# Altium project OTA.PrjPCB
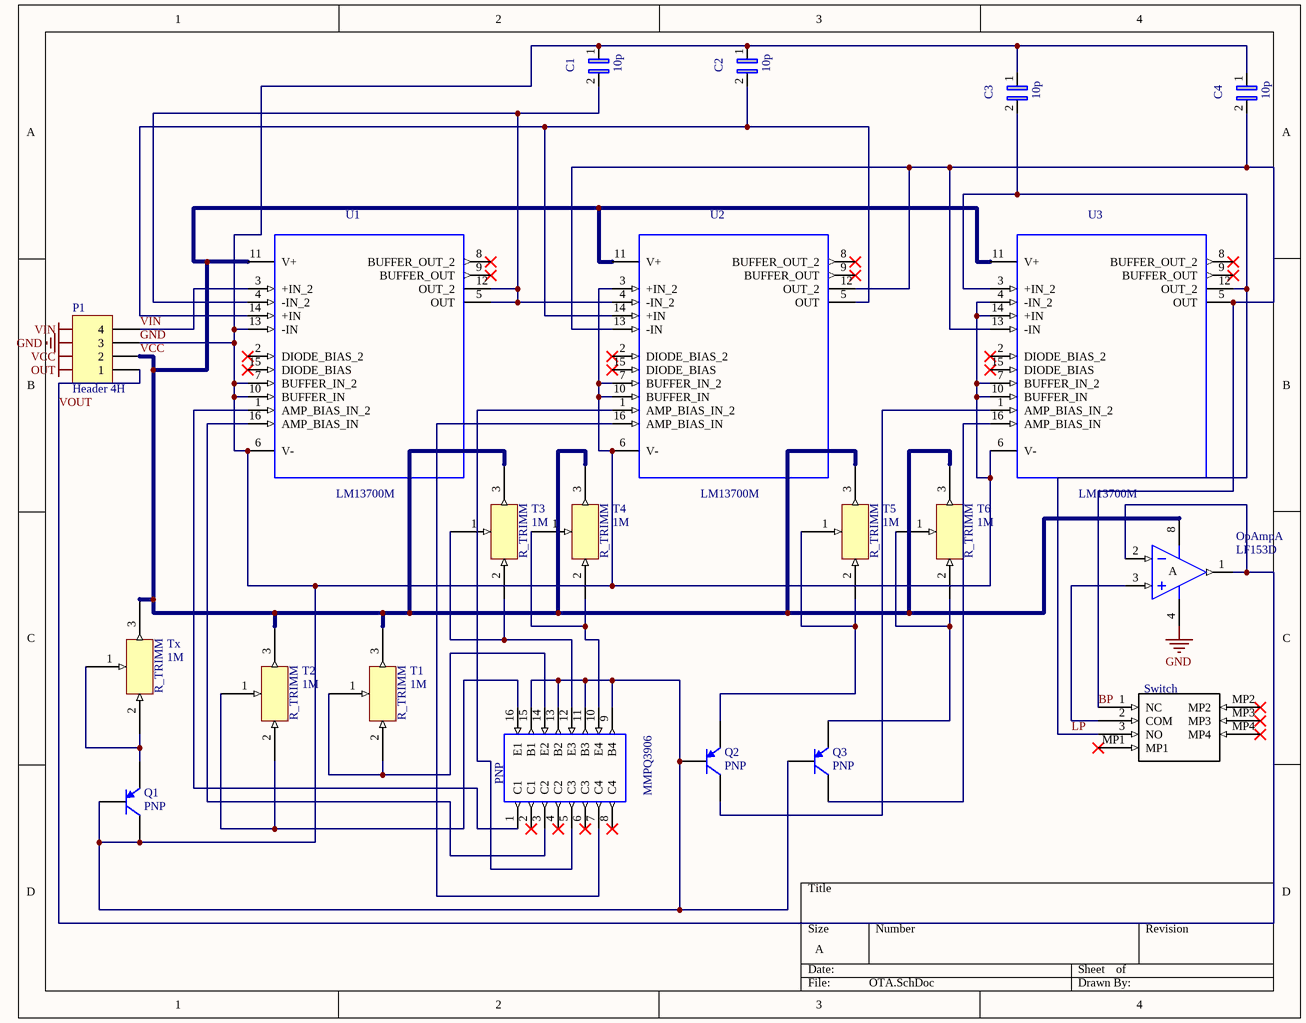
[diagram p0: OTA.SchDoc]
1 sheet, 21 parts. Net scope: global (net labels, ports and power ports of the same name join across sheets).
Board file: OTA1.PcbDoc

## Sheet OTA.SchDoc
size A

### Parts
C1  10p  [_C*CAPC1005X55N_CC0402C100K5GACAUTO_CPrimary_C]
C2  10p  [_C*CAPC1005X55N_CC0402C100K5GACAUTO_CPrimary_C]
C3  10p  [_C*CAPC1005X55N_CC0402C100K5GACAUTO_CPrimary_C]
C4  10p  [_C*CAPC1005X55N_CC0402C100K5GACAUTO_CPrimary_C]
OpAmp  LF153D  [SO8_N]  (part A of 2)
P1  Header 4H  [HDR1X4H]
PNP  MMPQ3906  [LM13700LM13700MLM13700LM13700MLM13700PrimaryLM13700]
Q1  PNP  [SOT-23B]
Q2  PNP  [SOT-23B]
Q3  PNP  [SOT-23B]
Switch  (no value)  [PCBComponent_1]
T1  1M  [PCBComponent_1]
T2  1M  [PCBComponent_1]
T3  1M  [PCBComponent_1]
T4  1M  [PCBComponent_1]
T5  1M  [PCBComponent_1]
T6  1M  [PCBComponent_1]
Tx  1M  [PCBComponent_1]
U1  LM13700M  [LM13700LM13700MLM13700LM13700MLM13700PrimaryLM13700]
U2  LM13700M  [LM13700LM13700MLM13700LM13700MLM13700PrimaryLM13700]
U3  LM13700M  [LM13700LM13700MLM13700LM13700MLM13700PrimaryLM13700]

### Nets
GND: C1.1 C2.1 C3.1 C4.1 OpAmp.4(V-) P1.3 PNP.9(B4) PNP.11(B3) PNP.13(B2) PNP.15(B1) Q1.1(C) Q1.2(B) Q2.2(B) Q3.2(B) U1.6(V-) U1.7(BUFFER_IN_2) U1.10(BUFFER_IN) U1.13(-IN) U2.3(+IN_2) U2.6(V-) U2.7(BUFFER_IN_2) U2.10(BUFFER_IN) U3.4(-IN_2) U3.6(V-) U3.7(BUFFER_IN_2) U3.10(BUFFER_IN) U3.14(+IN)
VCC: OpAmp.8(V+) P1.2 T1.3 T2.3 T3.3 T4.3 T5.3 T6.3 Tx.3 U1.11(V+) U2.11(V+) U3.11(V+)
VIN: P1.4 U1.3(+IN_2)
BP: C4.2 Switch.1(NC) U2.12(OUT_2) U2.13(-IN) U3.5(OUT) U3.13(-IN)
LP: C3.2 Switch.3(NO) U3.3(+IN_2) U3.12(OUT_2)
VOUT: OpAmp.1(OUT) OpAmp.2(IN-) P1.1
NetC1_2: C1.2 U1.4(-IN_2) U1.5(OUT) U1.12(OUT_2) U2.4(-IN_2)
NetC2_2: C2.2 U1.14(+IN) U2.5(OUT) U2.14(+IN)
NetOpAmp_3: OpAmp.3(IN+) Switch.2(COM)
NetPNP_1: PNP.1(C1) U1.1(AMP_BIAS_IN_2)
NetPNP_3: PNP.3(C2) U1.16(AMP_BIAS_IN)
NetPNP_5: PNP.5(C3) U2.1(AMP_BIAS_IN_2)
NetPNP_7: PNP.7(C4) U2.16(AMP_BIAS_IN)
NetPNP_10: PNP.10(E4) T4.1 T4.2
NetPNP_12: PNP.12(E3) T3.1 T3.2
NetPNP_14: PNP.14(E2) T1.1 T1.2
NetPNP_16: PNP.16(E1) T2.1 T2.2
NetQ1_3: Q1.3(E) Tx.1 Tx.2
NetQ2_1: Q2.1(C) U3.1(AMP_BIAS_IN_2)
NetQ2_3: Q2.3(E) T5.1 T5.2
NetQ3_1: Q3.1(C) U3.16(AMP_BIAS_IN)
NetQ3_3: Q3.3(E) T6.1 T6.2

Not connected (* = marked no-connect by the designer): PNP 2(C1)* 4(C2)* 6(C3)* 8(C4)*; Switch MP1* MP2* MP3* MP4*; U1 2(DIODE_BIAS_2)* 8(BUFFER_OUT_2)* 9(BUFFER_OUT)* 15(DIODE_BIAS)*; U2 2(DIODE_BIAS_2)* 8(BUFFER_OUT_2)* 9(BUFFER_OUT)* 15(DIODE_BIAS)*; U3 2(DIODE_BIAS_2)* 8(BUFFER_OUT_2)* 9(BUFFER_OUT)* 15(DIODE_BIAS)*

### Notes on the sheet
- Labels drawn without touching a wire or pin: GND, OUT, VCC, VIN
- (in symbol Component_1) R_TRIMM
- (in symbol LF153D, part A) A

### Library data of the parts
C1-C4 = C0402C100K5GACAUTO: CAPACITOR CERAMIC 10 PF 10% TOL 50V C0G 0402; MF: KEMET; SnapEDA_Link: https://www.snapeda.com/parts/C0402C100K5GACAUTO/KEMET/view-part/?ref=snap; Availability: Unavailable; MP: C0402C100K5GACAUTO; Package: 0402 KEMET; Price: None; Value: *
OpAmp = LF153D: Wide-Bandwidth Dual J-FET Operational Amplifier; Published: 24-Aug-2001; LatestRevisionDate: 13-Apr-2006; LatestRevisionNote: IPC-7351 Footprint Added.; DatasheetVersion: Jun-1998; PackageVersion: Dec-2002; PackageReference: SO8; Publisher: Altium Limited; PackageDescription: 8-Pin Small Outline Integrated Circuit 1.27 mm Pitch; Code_JEDEC: MS-012-AA; Code_IPC: SOIC127P600-8; ComponentLink1Description: Manufacturer Link; ComponentLink1URL: http://www.st.com/; ComponentLink2Description: Datasheet; ComponentLink2URL: http://www.st.com/stonline/products/literature/ds/2153/lf353.pdf
P1 = Header 4H: Header, 4-Pin, Right Angle; LatestRevisionDate: 17-Jul-2002; LatestRevisionNote: Re-released for DXP Platform.; Publisher: Altium Limited
PNP U1-U3 = LM13700M: Dual Operational Transconductance Amplifier with Linearizing Diodes and Buffers 16-SOIC 0 to 70; MF: Texas Instruments; Price: None; Availability: Unavailable; MP: LM13700M; Package: SOIC-16 Texas Instruments; SnapEDA_Link: https://www.snapeda.com/parts/LM13700M/Texas%20Instruments/view-part/?ref=snap; Value: *
Q1-Q3 = PNP: PNP Bipolar Transistor; Published: 8-Jun-2000; LatestRevisionDate: 17-Jul-2002; LatestRevisionNote: Re-released for DXP Platform.; PackageReference: SOT-23B; Publisher: Altium Limited; Code_JEDEC: SOT-23
Switch T1-T6 Tx = Component_1